# Altium schematic sheet [1] COVER PAGE.SchDoc: Cover page
size A3; CompanyName: RADWAG Wagi Elektroniczne; Organization: RADWAG Wagi Elektroniczne; Address1: ul. Bracka 28; Address2: 26-600 RADOM; Address3: POLAND; SheetNumber: 1; SheetTotal: 6
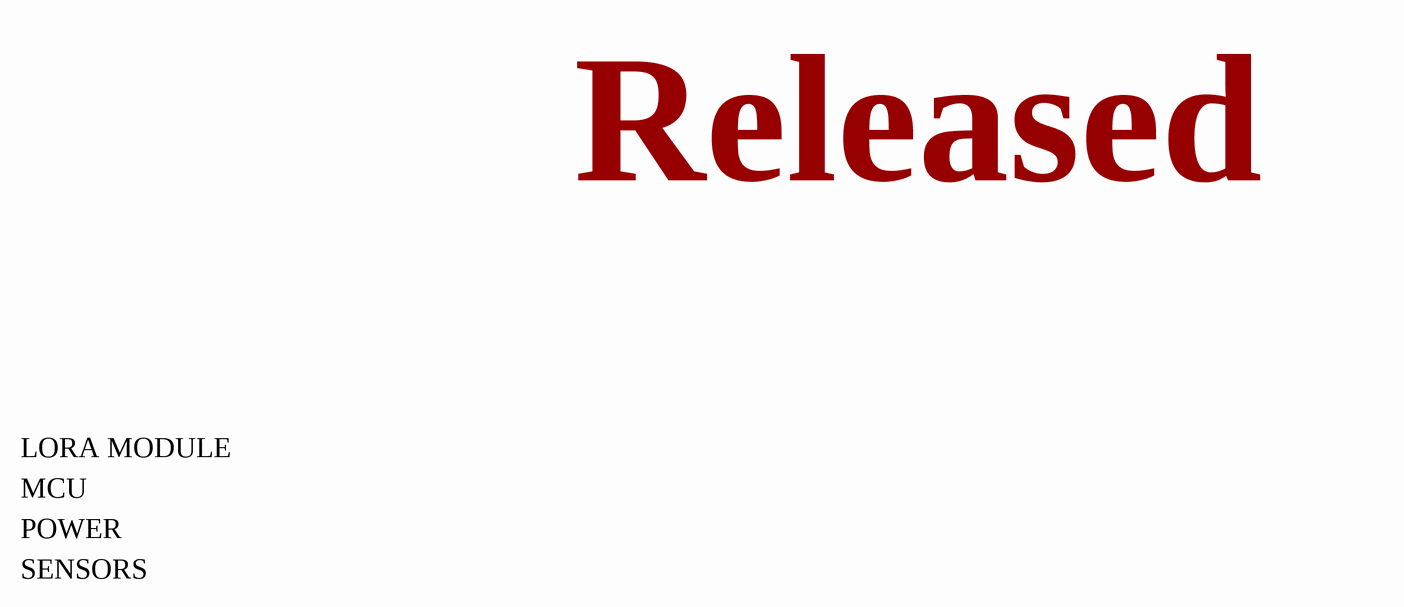
[diagram p0: [1] COVER PAGE.SchDoc]

## Notes on the sheet
- Released
- LORA MODULE
- MCU
- POWER
- SENSORS
- Variant:
- Page
- Index
- 1
- COVER PAGE
- 2
- 3
- BLOCK DIAGRAM
- 4
- 5
- 6
- 7
- 8
- 9
- 10
- DRAFT - Very early stage of schematic, ignore details.
- PRELIMINARY - Close to final schematic.
- RELEASED - A board with this schematic has been sent to production.
- CHECKED - There should not be any mistakes. Tell the engineer if you find one.
- Title:
- Size: A3
- Page contents:
- Date:
- Version:
- Drawn by:
- Issue:
- Sheet number:
- of